# EAGLE design MegaShield (EAGLE 9.2.2)
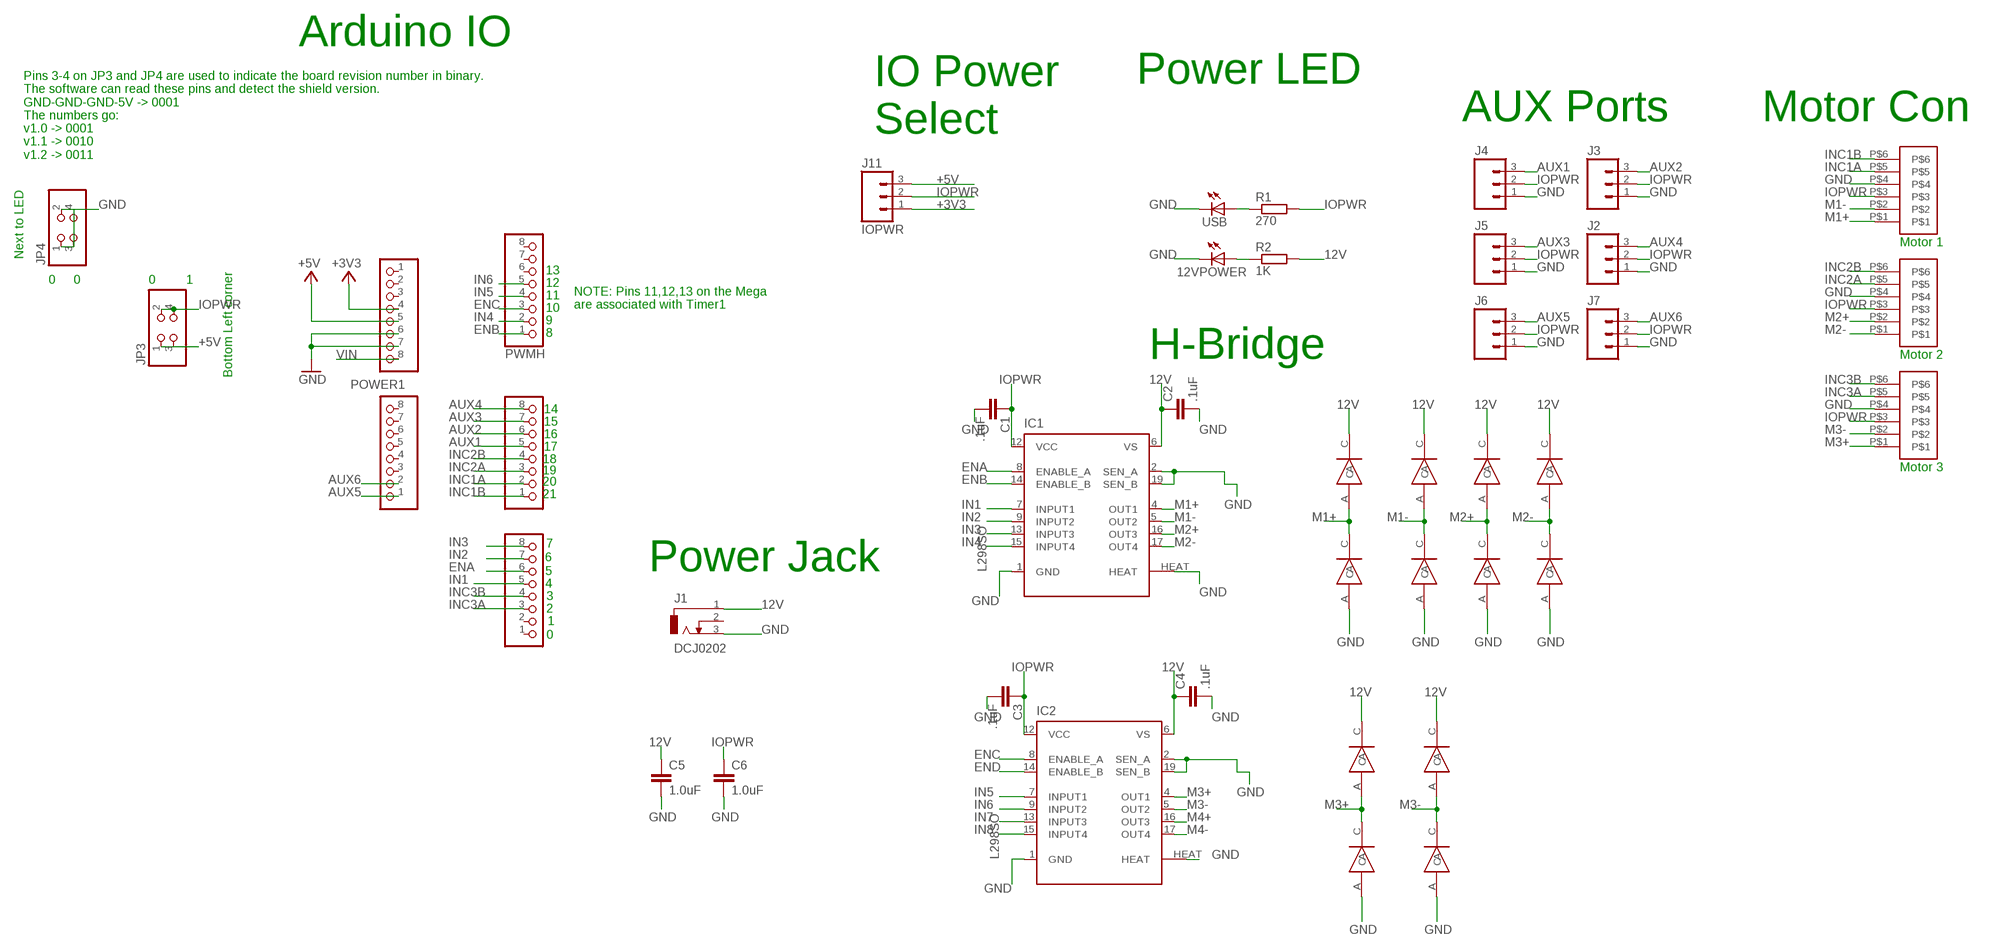
[diagram p0: schematic, sheet 1]

## Parts
12VPOWER  LED_E  [LED_1206]
C1  .1uF  C  [C0805]
C2  .1uF  C  [C0805]
C3  .1uF  C  [C0805]
C4  .1uF  C  [C0805]
C5  1.0uF  1.0UF-25V-+80/-20(0805)"  [0805-CAP]
C6  1.0uF  1.0UF-25V-+80/-20(0805)"  [0805-CAP]
COMMUNICATION  PINHD-1X8  [1X08]
COMMUNICATION1  PINHD-1X8  [1X08]
IC1  L298SO  [POWERSO-20]
IC2  L298SO  [POWERSO-20]
J1  DCJ0202  [DCJ0202]
J2  M03LOCK  [1X03_LOCK]
J3  M03LOCK  [1X03_LOCK]
J4  M03LOCK  [1X03_LOCK]
J5  M03LOCK  [1X03_LOCK]
J6  M03LOCK  [1X03_LOCK]
J7  M03LOCK  [1X03_LOCK]
J11  IOPWR  M03LOCK  [1X03_LOCK]
JP3  PINHD-2X2  [2X02]
JP4  PINHD-2X2  [2X02]
POWER1  8x1F-H8.5  PINHD-1X8  [1X08]
PWMH  PINHD-1X8  [1X08]
PWML  PINHD-1X8  [1X08]
R1  270  R  [R0805]
R2  1K  R  [R0805]
U$1  JST-PH-6  [JST-PHR-6-SMD]
U$2  MRA4004  [SMA]
U$3  MRA4004  [SMA]
U$4  MRA4004  [SMA]
U$5  MRA4004  [SMA]
U$6  MRA4004  [SMA]
U$7  MRA4004  [SMA]
U$8  MRA4004  [SMA]
U$9  MRA4004  [SMA]
U$10  MRA4004  [SMA]
U$11  MRA4004  [SMA]
U$12  JST-PH-6  [JST-PHR-6-SMD]
U$13  MRA4004  [SMA]
U$14  MRA4004  [SMA]
U$20  JST-PH-6  [JST-PHR-6-SMD]
USB  LED_E  [LED_1206]

## Nets
12V: C2.1 C4.1 C5.1 IC1.6(VS) IC2.6(VS) J1.1 R2.2 U$2.C U$3.C U$5.C U$7.C U$9.C U$13.C
+3V3: J11.1 POWER1.4
+5V: J11.3 JP3.1 JP3.3 POWER1.5
AUX1: COMMUNICATION.5 J4.3
AUX2: COMMUNICATION.6 J3.3
AUX3: COMMUNICATION.7 J5.3
AUX4: COMMUNICATION.8 J2.3
AUX5: COMMUNICATION1.1 J6.3
AUX6: COMMUNICATION1.2 J7.3
ENA: IC1.8(ENABLE_A) PWML.6
ENB: IC1.14(ENABLE_B) PWMH.1
ENC: IC2.8(ENABLE_A) PWMH.3
END: IC2.14(ENABLE_B)
GND [gnd]: 12VPOWER.C C1.2 C2.2 C3.2 C4.2 C5.2 C6.2 IC1.1(GND) IC1.2(SEN_A) IC1.19(SEN_B) IC1.HEAT IC2.1(GND) IC2.2(SEN_A) IC2.19(SEN_B) IC2.HEAT J1.3 J2.1 J3.1 J4.1 J5.1 J6.1 J7.1 JP4.1 JP4.2 JP4.3 JP4.4 POWER1.6 POWER1.7 U$1.P$4 U$4.A U$6.A U$8.A U$10.A U$11.A U$12.P$4 U$14.A U$20.P$4 USB.C
IN1: IC1.7(INPUT1) PWML.5
IN2: IC1.9(INPUT2) PWML.7
IN3: IC1.13(INPUT3) PWML.8
IN4: IC1.15(INPUT4) PWMH.2
IN5: IC2.7(INPUT1) PWMH.4
IN6: IC2.9(INPUT2) PWMH.5
IN7: IC2.13(INPUT3)
IN8: IC2.15(INPUT4)
INC1A: COMMUNICATION.2 U$1.P$5
INC1B: COMMUNICATION.1 U$1.P$6
INC2A: COMMUNICATION.3 U$12.P$5
INC2B: COMMUNICATION.4 U$12.P$6
INC3A: PWML.3 U$20.P$5
INC3B: PWML.4 U$20.P$6
IOPWR [power]: C1.1 C3.1 C6.1 IC1.12(VCC) IC2.12(VCC) J2.2 J3.2 J4.2 J5.2 J6.2 J7.2 J11.2 JP3.2 JP3.4 R1.2 U$1.P$3 U$12.P$3 U$20.P$3
M1+: IC1.4(OUT1) U$1.P$1 U$3.A U$4.C
M1-: IC1.5(OUT2) U$1.P$2 U$5.A U$6.C
M2+: IC1.16(OUT3) U$7.A U$8.C U$12.P$2
M2-: IC1.17(OUT4) U$9.A U$10.C U$12.P$1
M3+: IC2.4(OUT1) U$2.A U$11.C U$20.P$1
M3-: IC2.5(OUT2) U$13.A U$14.C U$20.P$2
M4+: IC2.16(OUT3)
M4-: IC2.17(OUT4)
N$2: R1.1 USB.A
N$3: 12VPOWER.A R2.1
VIN [power]: POWER1.8
Unconnected: COMMUNICATION1.3 COMMUNICATION1.4 COMMUNICATION1.5 COMMUNICATION1.6 COMMUNICATION1.7 COMMUNICATION1.8 J1.2 POWER1.1 POWER1.2 POWER1.3 PWMH.6 PWMH.7 PWMH.8 PWML.1 PWML.2

## Notes on the sheet
- Arduino IO
- Power LED
- AUX Ports | Motor Con
- IO Power
  Select
- Pins 3-4 on JP3 and JP4 are used to indicate the board revision number in binary. 
  The software can read these pins and detect the shield version.
  GND-GND-GND-5V -> 0001
  The numbers go:
  v1.0 -> 0001
  v1.1 -> 0010
  v1.2 -> 0011
- Motor 1
- Next to LED
- Bottom Left corner | 13
- 0 | 0 | 0 | 1 | 12
- 11
- NOTE: Pins 11,12,13 on the Mega 
  are associated with Timer1
- 10
- 9
- 8
- H-Bridge | Motor 2
- 14
- 15
- 16
- 17
- 18
- 19 | Motor 3
- 20
- 21
- 7
- 6
- Power Jack
- 5
- 4
- 3
- 2
- 1
- 0

## Library data of the parts
12VPOWER USB = eagle-ltspice:LED_E: LED Source: http://www.osram.convergy.de Source: www.luxeon.com Source: www.kingbright.com; SPICEMODEL: NONE; SPICEPREFIX: D; SPICETYPE: diode
C1-C4 = eagle-ltspice:C: CAPACITOR, European symbol; SPICEMODEL: NONE; SPICEPREFIX: C
C5 C6 = SparkFun-Capacitors:1.0UF-25V-+80/-20(0805): CAP-11625; PROD_ID: CAP-11625
COMMUNICATION COMMUNICATION1 PWMH PWML = pinhead:PINHD-1X8: PIN HEADER
IC1 IC2 = st-microelectronics:L298: DUAL FULL-BRIDGE DRIVER
J1 = con-jack:DCJ0202: DC POWER JACK Source: DCJ0202.pdf; OC_FARNELL: unknown; OC_NEWARK: unknown
J2-J7 J11 = SparkFun-Connectors:M03: Header 3 Standard 3-pin 0.1" header. Use with straight break away headers (SKU : PRT-00116), right angle break away headers (PRT-00553), swiss pins (PRT-00743), machine pins (PRT-00117), and female headers (PRT-00115). Molex polarized connector foot print use with SKU : PRT-08232 with associated crimp pins and housings.
JP3 JP4 = pinhead:PINHD-2X2: PIN HEADER
POWER1 = SmartPrj:PINHD-1X8: PIN HEADER
R1 R2 = eagle-ltspice:R: RESISTOR, European symbol; SPICEMODEL: NONE; SPICEPREFIX: R
U$1 U$12 U$20 = JST-CON:JST-PH-6
U$2-U$11 U$13 U$14 = MakesmithDiode:MRA4004

## Net classes
1 power: width 0.61 mm, drill 0.711 mm, clearance 0.203 mm
2 gnd: width 0.305 mm, drill 0.711 mm, clearance 0.203 mm
3 usbvcc: width 0.508 mm, drill 0.711 mm, clearance 0.203 mm

## Board
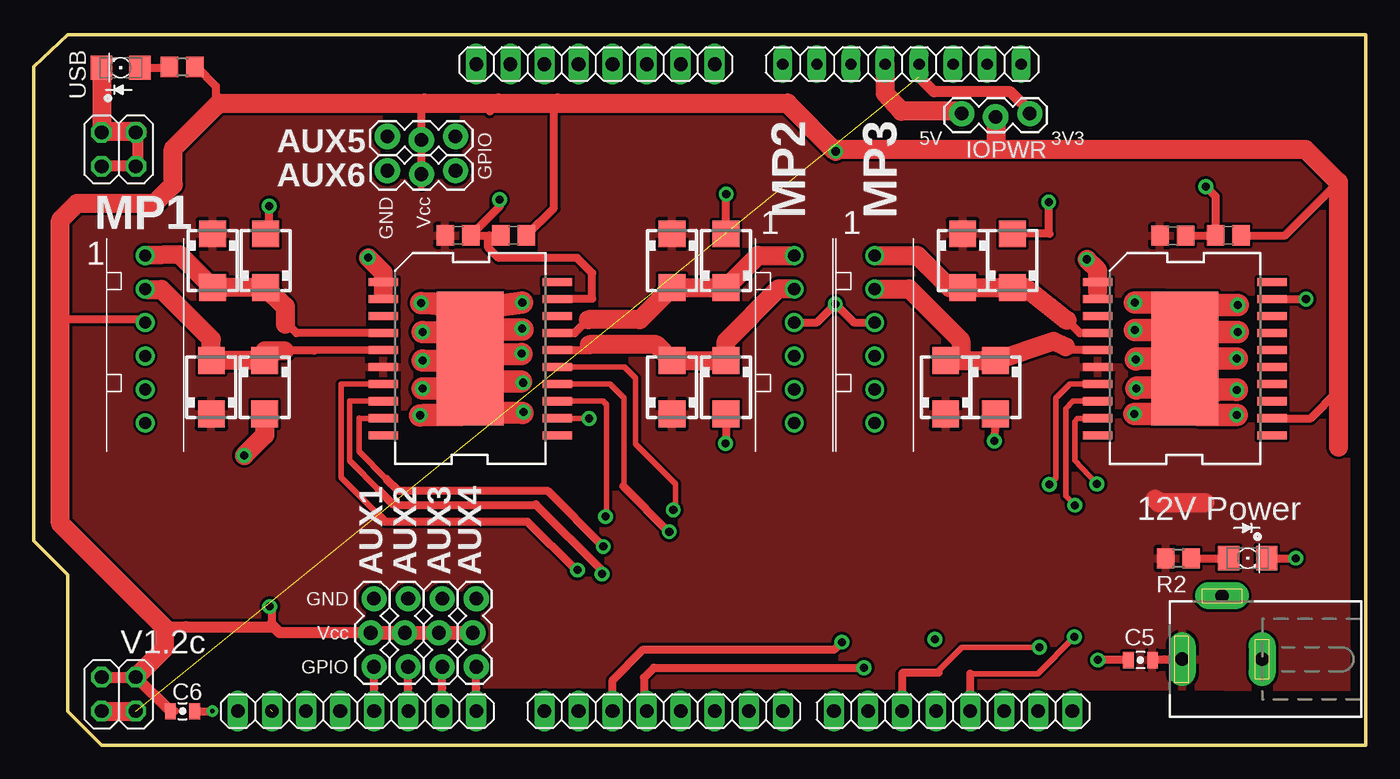
[diagram p1: board, top side]
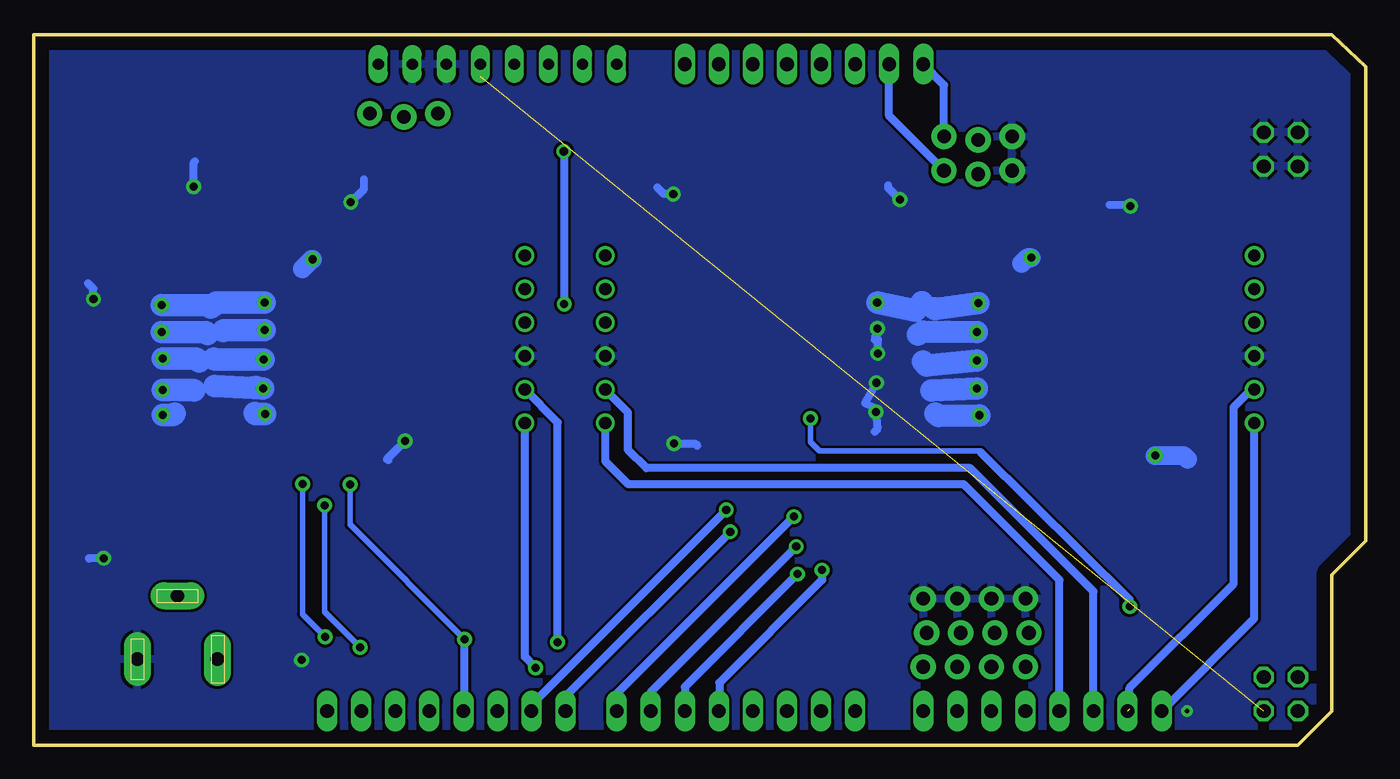
[diagram p2: board, bottom side, seen from below]

Size 99.36 x 53 mm. Coordinates in mm from the lower left corner, seen from the top.
Outline: 5.08,0 2.54,2.54 2.54,12.7 0,15.24 0,50.62 2.53,52.99 2.54,53 99.36,53 99.36,0 5.08,0
Copper layers (1*16): Top 0.035mm / dielectric 1.5mm / Bottom 0.035mm
Design rules "default *": minimum track width 8mil, minimum drill 16mil, track to track 8mil, track to pad 8mil, pad to pad 8mil, via to via 10mil, smd to smd 8mil, copper to edge 40mil, drill to drill 12mil, minimum pad ring 10mil, minimum via ring 10mil, stop-mask expansion 4mil, vias tented up to drill 0mil, thermal gap 10mil

### Footprints (pad centres in the part's own frame; a part is rotated, then mirrored left to right if it is on the bottom)
LED_1206 = smd 1.6 x 1.803: A -1.422,0; C 1.422,0
C0805 = smd 1.3 x 1.5: 1 -0.95,0; 2 0.95,0
0805-CAP = smd 0.8 x 1.2: 1 -0.9,0; 2 0.9,0
1X08 = drill 1.016 long: 1 -8.89,0; 2 -6.35,0; 3 -3.81,0; 4 -1.27,0; 5 1.27,0; 6 3.81,0; 7 6.35,0; 8 8.89,0
POWERSO-20 = smd 0.6 x 2.2: 1 -5.715,-6.5; 2 -4.445,-6.5; 3 -3.175,-6.5; 4 -1.905,-6.5; 5 -0.635,-6.5; 6 0.635,-6.5; 7 1.905,-6.5; 8 3.175,-6.5; 9 4.445,-6.5; 10 5.715,-6.5; 11 5.715,6.5; 12 4.445,6.5; 13 3.175,6.5; 14 1.905,6.5; 15 0.635,6.5; 16 -0.635,6.5; 17 -1.905,6.5; 18 -3.175,6.5; 19 -4.445,6.5; 20 -5.715,6.5 | smd 10 x 5: HEAT 0,0
DCJ0202 = drill 1 pad 2 long: 1 0.005,2.977; 2 4.73,-0.01; 3 0,-3
1X03_LOCK = drill 1.016 pad 1.88: 1 0,0.127; 2 2.54,-0.127; 3 5.08,0.127
2X02 = drill 1.016 octagon: 1 -1.27,-1.27; 2 -1.27,1.27; 3 1.27,-1.27; 4 1.27,1.27
1X08' = drill 0.85 pad 1.422 long: 1 -8.89,0; 2 -6.35,0; 3 -3.81,0; 4 -1.27,0; 5 1.27,0; 6 3.81,0; 7 6.35,0; 8 8.89,0
R0805 = smd 1.3 x 1.5: 1 -0.95,0; 2 0.95,0
JST-PHR-6-SMD = drill 0.9: P$1 0,0; P$2 2.5,0; P$3 5,0; P$4 7.5,0; P$5 10,0; P$6 12.5,0
SMA = smd 2 x 2: A 2,0; C -2,0

### Placement (x,y rotation side)
12VPOWER  90.55,13.95 0 top
C1  35.8,38.03 180 top
C2  31.65,38.03 0 top
C3  89.11,38.03 180 top
C4  84.96,38 0 top
C5  82.55,6.35 180 top
C6  11.11,2.54 0 top
COMMUNICATION  24.13,2.54 0 top
COMMUNICATION1  41.91,50.8 0 top
IC1  32.57,28.83 270 top
IC2  85.87,28.83 270 top
J1  88.63,6.41 90 top
J2  32.89,10.92 270 top
J3  27.81,10.92 270 top
J4  25.27,10.92 270 top
J5  30.35,10.92 270 top
J6  26.39,45.28 0 top
J7  26.39,42.73 0 top
J11  69.21,46.99 0 top
JP3  6.35,3.81 0 top
JP4  6.35,44.45 0 top
POWER1  8x1F-H8.5  [1X08']  64.77,50.8 0 top
PWMH  68.58,2.54 0 top
PWML  46.99,2.54 0 top
R1  11.09,50.59 0 top
R2  85.38,13.93 180 top
U$1  8.33,36.53 270 top
U$2  69.29,36.15 270 top
U$3  13.35,36.15 270 top
U$4  17.3,36.15 90 top
U$5  13.26,26.7 90 top
U$6  17.25,26.7 270 top
U$7  47.62,26.7 90 top
U$8  51.64,26.7 270 top
U$9  47.62,36.15 270 top
U$10  51.64,36.15 90 top
U$11  72.99,36.15 90 top
U$12  56.73,36.53 270 top
U$13  68.02,26.7 90 top
U$14  71.72,26.7 270 top
U$20  62.73,36.53 270 top
USB  6.5,50.53 180 top

### Tracks (layer width: path | path; a pad name or v marks a point on that pad's centre or on a via)
12V
  Top 0.61: C5.1 83.52,6.42 J1.1
  Top 1.422: 83.65,18.36 83.92,18.09 87.37,18.09
  pour Top: -2.5,53.08 101.93,53.24 100.25,4.28 -2.94,4.62
+3V3
  Top 1.422: J11.1 69.05,47.28 64.71,47.28 63.5,48.62 POWER1.4
+5V  (1 unrouted)
  Top 0.813: 74.3,47.31 72.87,48.74 67.15,48.74 66.04,49.85 POWER1.5
  Top 1.422: JP3.1 JP3.3 | 74.3,47.31 J11.3
AUX1
  Top 0.61: COMMUNICATION.5 25.4,4.27 J4.3
AUX2
  Top 0.61: COMMUNICATION.6 27.94,4.27 J3.3
AUX3
  Top 0.61: COMMUNICATION.7 30.48,4.27 J5.3
AUX4
  Top 0.61: COMMUNICATION.8 33.02,4.27 J2.3
AUX5
  Bottom 0.61: J6.3 31.47,49.25 COMMUNICATION1.1
AUX6
  Bottom 0.61: J7.3 35.56,46.94 COMMUNICATION1.2
ENA  (via drill 0.6)
  Top 0.406: 25.77,19.02 23.56,21.23 23.56,25.64 23.58,25.66 IC1.8
  Top 0.61: 37.45,17.97 37.49,17.93 | 25.77,19.02 26.85,17.93 37.49,17.93 | 37.49,17.93 42.39,13.04 v42.39,12.76
  Bottom 0.61: v42.39,12.76 50.8,4.35 PWML.6
ENB  (via drill 0.6)
  Top 0.406: IC1.14 43.01,26.93 44.05,25.89 44.05,19.4 43.97,19.33
  Top 0.61: 43.97,19.33 47.37,15.93 v47.41,15.93
  Bottom 0.61: v47.41,15.93 59.69,3.64 PWMH.1
ENC  (via drill 0.6)
  Top 0.406: 67.51,5.41 67.51,5.6 69.22,7.31 v75.02,7.31 | IC2.8 77.5,25.66 76.98,25.13 76.98,18.59 v77.67,17.9
  Top 0.61: 67.51,5.41 64.85,5.41 64.77,5.33 PWMH.3
  Bottom 0.406: v77.67,17.9 77.67,9.96 v75.02,7.31
GND  (via drill 0.35, 0.6)
  Top 0.61: C4.2 C3.2 88.16,40.93 v87.41,41.67 | 12VPOWER.C v94.13,13.95 | v94.13,13.95 | IC2.19 v94.88,33.28 v94.9,33.27 | U$11.A 75.77,38.15 75.7,38.21 v75.7,40.5 | U$14.A 71.64,22.93 v71.65,22.69 | U$10.A 51.64,41.1 v51.66,41.11 | 33.98,38.03 C2.2 34.76,40.18 v34.76,40.7 | 33.98,38.03 C1.2 | IC1.19 39.1,33.3 41.67,33.3 41.67,35.22 40.54,36.35 34.68,36.35 33.9,37.13 33.9,37.95 33.98,38.03 | U$4.A 17.58,38.43 v17.58,40.22 | U$8.A 51.64,22.54 v51.6,22.5 | 36.38,29.17 v36.41,29.23 | IC1.HEAT 32.57,29.14 33.28,30.02 34.27,31.01 | 36.48,30.99 v36.42,31.09 | IC1.HEAT 32.57,28.43 33.88,27.11 | 36.34,27.11 v36.5,27.03 | IC1.HEAT 32.57,26.48 32.81,26.24 33.72,24.82 | 36.48,24.78 v36.55,24.86 | 26.07,35.25 IC1.1 | IC1.2 26.08,33.79 | 79.35,33.82 79.37,33.82 IC2.2 | C6.2 v13.34,2.54 | C5.2 v79.38,6.35
  Top 0.813: USB.C | 7.75,45.73 7.75,43.31 JP4.3 JP4.1
  Top 1.422: U$6.A 17.25,23.14 v15.71,21.61 | v24.95,36.37 26.07,35.25 26.08,35.25 26.08,33.79 | v78.56,36.24 79.37,35.43 IC2.1 79.35,34.55 79.35,33.82 | USB.C 5.08,45.8 | 5.08,45.8 JP4.2 | 5.08,45.8 7.68,45.8 7.75,45.73
  Top 1.676: IC1.HEAT 32.86,28.83 | 32.86,28.83 32.64,29.12 | 32.64,29.12 36.38,29.17 | 34.27,31.01 36.48,30.99 | 33.88,27.11 36.34,27.11 | 33.72,24.82 36.48,24.78 | 33.28,30.02 33.5,30.8 | 33.5,30.8 33.5,31.8 | 33.5,31.8 33.5,33.01 33.66,32.66 35.65,32.91 v36.45,33.02 | 32.81,26.24 32.81,26.09 31.86,24.64 29.14,24.62 v28.83,24.61 | 32.64,29.12 32.86,27.48 31.98,26.62 v29.01,26.59 | 32.86,28.83 32.86,28.72 33.39,28.39 30.29,28.66 v29.01,28.68 | 33.5,30.8 v29.01,30.83 | 33.5,31.8 33.01,31.8 32.21,32.6 29.79,32.96 v28.91,32.99 | IC2.HEAT 89.69,28.83 v89.72,28.86 | IC2.HEAT 82.24,28.83 v82.19,28.78 | IC2.HEAT 85.87,30.14 86.03,30.3 | 86.03,30.3 86.56,30.83 v89.82,30.83 | IC2.HEAT 84.88,30.96 v82.14,30.96 | 86.03,31.27 86.03,32.72 86.14,32.83 v89.8,32.83 | 86.03,30.3 86.03,31.27 | 86.03,31.27 84.27,33.03 v82.12,33.03 | IC2.HEAT 85.87,27.71 88.1,26.42 | 88.1,26.42 87.05,26.53 89.72,26.53 v89.75,26.5 | 88.1,26.42 86.15,26.84 | 86.15,26.84 85.2,27.05 84.83,26.68 82.29,26.68 v82.23,26.62 | 86.15,26.84 86.15,26.51 85.19,25.55 | 85.19,25.55 84.36,24.72 v82.11,24.72 | 85.19,25.55 85.96,25.55 86.88,24.63 v89.72,24.63
  Bottom 0.61: v94.13,13.95 95.21,13.95 95.21,13.92 | v87.41,41.67 87.41,43.45 87.32,43.55 | v94.9,33.27 94.9,34.05 95.29,34.44 | v75.7,40.5 74.72,41.48 74.72,42.19 | v71.65,22.69 73,21.35 72.91,21.25 | v51.66,41.11 52.36,41.11 52.87,41.62 | v34.76,40.7 35.61,41.56 35.61,41.76 | v17.58,40.22 17.67,40.3 19.12,40.3 | v51.6,22.5 50.01,22.5 49.86,22.35 | v36.41,29.23 36.39,30.24 36.6,30.45 | v36.42,31.09 36.54,30.34 36.65,30.24 | v36.5,27.03 37.36,25.52 36.6,25.17 | v36.55,24.86 36.44,23.58 36.65,23.37
  Bottom 1.422: v15.71,21.61 13.59,21.61 13.32,21.34 | v24.95,36.37 25.25,36.37 25.69,35.92 | v78.56,36.24 78.61,36.24 79.3,35.55
  Bottom 1.676: v36.45,33.02 33.59,32.43 33.1,33.05 | v28.83,24.61 31.9,24.55 32.12,24.75 | v29.01,26.59 32.39,26.47 32.42,26.44 | v29.01,28.68 32.77,28.34 33.04,28.6 | v29.01,30.83 33.04,30.86 33.42,30.65 | v28.91,32.99 32.15,32.55 32.21,32.6 | v89.72,28.86 87.23,28.86 87.01,28.64 | v82.19,28.78 85.87,28.78 85.92,28.83 | v89.82,30.83 86.54,30.83 86.36,30.66 | v82.14,30.96 85.16,30.96 85.23,30.88 | v89.8,32.83 86.31,32.83 86.14,32.66 | v82.12,33.03 85.75,33.03 86.09,32.69 | v89.75,26.5 87.41,26.5 87.38,26.47 | v82.23,26.62 82.31,26.59 | 82.31,26.59 85.84,26.8 | 82.31,26.59 83.06,26.68 82.76,26.71 | v82.11,24.72 82.82,24.72 82.88,24.78 | v89.72,24.63 88.95,24.63 88.83,24.75
  pour Bottom: -2.03,54.76 99.55,54.04 99.13,-0.41 53.78,0.1 -2.76,-2.15
IN1  (via drill 0.6)
  Top 0.406: 25.59,17.31 22.94,19.96 22.94,26.91 22.95,26.93 IC1.7
  Top 0.61: 25.59,17.31 26.22,16.69 36.82,16.69 40.45,13.06 v40.56,13.06
  Bottom 0.61: v40.56,13.06 40.56,12.32 48.22,4.66 48.22,2.58 PWML.5
IN2  (via drill 0.6)
  Top 0.406: 26.3,19.87 24.27,21.9 24.27,24.39 24.28,24.39 IC1.9
  Top 0.61: 26.3,19.87 27.19,18.99 38.31,18.99 v42.49,14.81
  Bottom 0.61: v42.49,14.81 53.34,3.96 PWML.7
IN3  (via drill 0.6)
  Top 0.406: IC1.13 42.46,25.66 42.71,25.4 42.71,17.11 v42.66,17.05
  Bottom 0.61: PWML.8 55.88,3.83 v42.66,17.05
IN4  (via drill 0.6)
  Top 0.406: IC1.15 44.09,28.2 44.9,27.38 44.9,22.47 47.89,19.49 47.89,17.73 v47.71,17.55
  Top 0.61: 47.62,17.55 v47.71,17.55
  Bottom 0.61: v47.71,17.55 62.23,3.02 PWMH.2
IN5  (via drill 0.6)
  Top 0.406: IC2.7 77.27,26.93 76.26,25.91 76.26,19.94 v75.76,19.45
  Bottom 0.406: v75.76,19.45 75.76,16.46 v67.21,7.91
  Bottom 0.61: PWMH.4 67.21,2.64 v67.21,7.91
IN6  (via drill 0.6)
  Top 0.406: 69.85,5.34 74.88,5.34 v77.62,8.07 | IC2.9 77.84,24.39 77.67,24.13 77.67,21.25 v79.31,19.49
  Top 0.61: PWMH.5 69.85,5.34
  Bottom 0.406: v79.31,19.49 79.31,9.78 77.62,8.09 v77.62,8.07
INC1A  (1 unrouted)
  Bottom 0.61: 17.64,2.68 17.64,4.26 9.86,12.04 9.86,24.54 9.87,24.55 9.87,25.22 8.56,26.53 U$1.P$5
INC1B
  Bottom 0.61: COMMUNICATION.1 8.33,9.45 U$1.P$6
INC2A
  Bottom 0.61: COMMUNICATION.3 20.32,11.47 29.52,20.67 53.67,20.67 55.03,22.04 55.03,24.83 U$12.P$5
INC2B
  Bottom 0.61: COMMUNICATION.4 22.86,12.32 29.99,19.46 55.01,19.46 56.72,21.17 U$12.P$6
INC3A  (via drill 0.6)
  Top 0.61: PWML.3 43.18,4.85 45.46,7.13 59.72,7.13 v60.27,7.69 | U$20.P$5
  Bottom 0.61: v60.27,7.69 60.27,24.08 U$20.P$5
INC3B  (via drill 0.6)
  Top 0.61: v61.93,5.78 46.26,5.78 45.52,5.04 45.52,2.74 arc90 PWML.4
  Bottom 0.61: v61.93,5.78 62.73,6.57 U$20.P$6
IOPWR  (via drill 0.6)  (1 unrouted)
  Top 0.406: IC1.12 41.4,24.39 v41.42,24.36
  Top 0.61: R1.2 12.16,50.59 13.59,49.17 13.59,47.66 | U$1.P$3 8.12,31.74 2.01,31.74 | v59.82,44.29 59.82,44.45 | 56.24,47.91 56.24,47.87 | 34.03,47.26 34.67,47.91 | 29.13,47.91 28.93,47.7 J6.2 J7.2 28.93,41.76 | 39.11,47.91 38.8,47.6 38.8,40.08 C1.1 | 97.37,22.16 97.3,22.23 | v17.62,10.34 17.74,10.22 17.74,8.98 17.74,8.84 | IC2.12 95.23,24.39 97.3,26.46 | C3.1 93.33,38.03 97.3,42 | U$20.P$3 61.17,31.53 v59.79,32.91 58.41,31.53 U$12.P$3 | C6.1 10.53,2.54
  Top 0.813: J4.2 18.34,8.38 17.74,8.98 | 17.74,8.84 11.38,8.84 11.34,8.79 9.74,8.79 9.61,8.93 | JP3.2 JP3.4 7.67,5.08 C6.1
  Top 1.016: J4.2 J3.2 J5.2 J2.2
  Top 1.422: 56.24,47.91 39.11,47.91 34.67,47.91 29.13,47.91 13.84,47.91 13.59,47.66 10.43,44.5 10.43,41.8 9.05,40.42 3.25,40.42 2.01,39.17 2.01,31.74 2.01,16.52 9.61,8.93 9.77,8.77 9.77,7.23 JP3.4 | 97.3,22.23 97.3,26.46 97.3,42 94.85,44.45 71.75,44.45 | v59.82,44.29 56.24,47.87 | 59.82,44.45 71.75,44.45 | J11.2 71.75,44.45
  Bottom 0.406: v41.42,24.36 41.42,22.61 40.74,21.93 28.81,21.93 28.72,21.84
  Bottom 0.61: 28.72,21.84 17.62,10.85 v17.62,10.34 | v59.82,44.29 59.79,44.26 v59.79,32.91
M1+
  Top 0.61: IC1.4 19.61,30.73 18.76,31.58
  Top 1.422: U$1.P$1 10.9,36.59 U$3.A 17.25,34.15 U$4.C 18.76,32.74 18.76,31.58 18.76,31.39
M1-
  Top 0.61: IC1.5 20.96,29.43 18.72,29.43
  Top 1.422: U$1.P$2 8.43,34 9.55,34 13.26,30.28 U$5.A | 18.72,29.43 17.25,29.43 U$6.C U$5.A | 13.26,28.74 U$5.A
M2+
  Top 0.61: IC1.16 41.43,29.47 41.43,29.87
  Top 1.422: 41.43,29.87 46.45,29.87 U$7.A U$8.C 51.64,30.13 55.56,34.05 56.71,34.05 U$12.P$2
M2-
  Top 0.61: 41.35,31.74 40.35,30.74 IC1.17
  Top 1.422: U$12.P$1 54.02,36.53 U$10.C U$9.A 45.22,31.74 41.35,31.74
M3+
  Top 0.61: IC2.4 78.02,30.74 77.07,31.69
  Top 1.422: U$20.P$1 65.91,36.53 68.31,34.13 69.27,34.13 U$2.A U$11.C 73.95,34.15 77.07,31.69
M3-
  Top 0.61: IC2.5 77.22,29.47 76.97,29.72
  Top 1.422: U$20.P$2 65.31,34.03 69.15,30.19 69.15,28.84 U$13.A U$14.C 76.07,30.13 76.97,29.72
N$2
  Top 0.61: USB.A 10.07,50.53 R1.1
N$3
  Top 0.61: R2.1 89.12,13.93 12VPOWER.A

### Text on the board
tPlace: AUX5 | GPIO | 5V | 3V3 | AUX6 | GND | Vcc | MP1 | MP2 | MP3 | 1 | 1 | 1 | 12V Power | AUX1 | AUX2 | AUX3 | AUX4 | GND | Vcc | V1.2c | GPIO